# Altium schematic sheet power_supplies.SchDoc
size A4; SheetNumber: 2; SheetTotal: 8
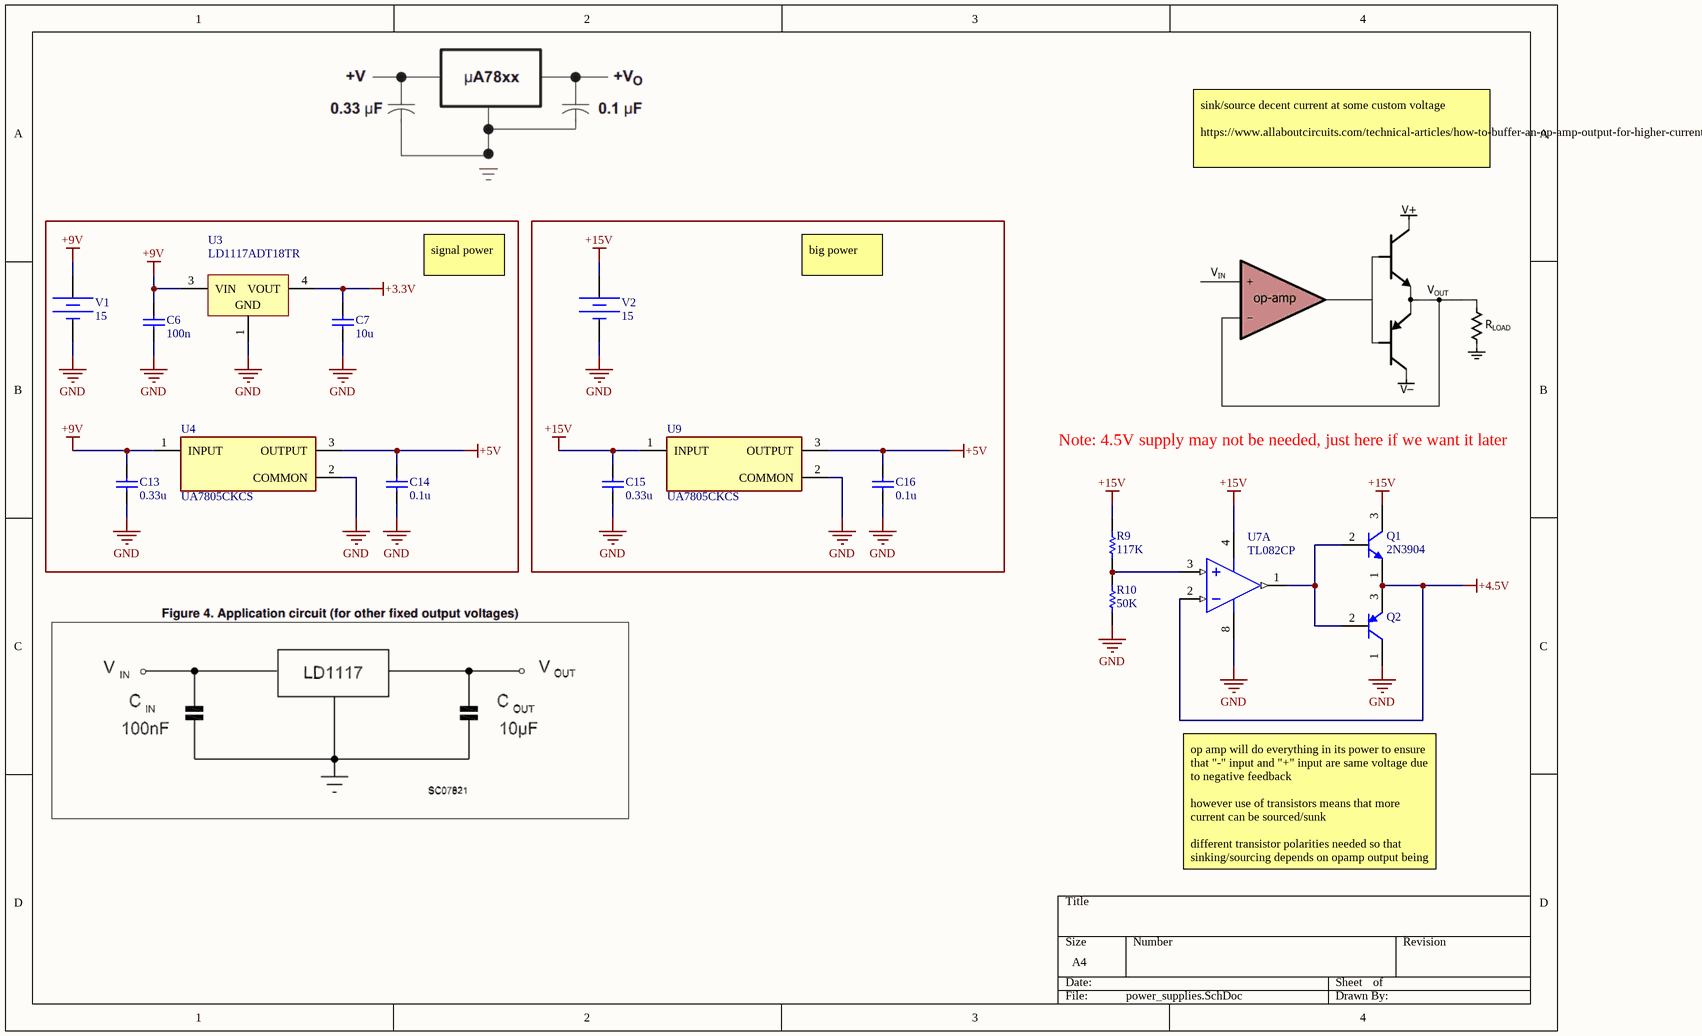
[diagram p0: power_supplies.SchDoc]

## Parts
C6  value 100n  (hidden comment: Capacitor)
C7  value 10u  (hidden comment: Capacitor)
C13  value 0.33u  (hidden comment: Capacitor)
C14  value 0.1u  (hidden comment: Capacitor)
C15  value 0.33u  (hidden comment: Capacitor)
C16  value 0.1u  (hidden comment: Capacitor)
Q1  2N3904  [ONSC-TO-92-3-29-11]
Q2  BC327-40ZL1G  [ONSC-TO-92-3-29-11_AM_BL]  (value not drawn)
R9  value 117K  (hidden comment: Resistor)
R10  value 50K  (hidden comment: Resistor)
U3  LD1117ADT18TR  [TO-252_N]
U4  UA7805CKCS  [FP-KCS0003B-MFG]
U7  TL082CP  [P0008A]  (part A of 2)
U9  UA7805CKCS  [FP-KCS0003B-MFG]
V1  DC Magnitude: 15  (hidden comment: Constant Voltage Source)
V2  DC Magnitude: 15  (hidden comment: Constant Voltage Source)

## Nets
+3.3V: C7.1 U3.4(VOUT)
+4.5V: Q1.1(E) Q2.3(E) U7.2(IN1-)
+5V: C14.1 C16.1 U4.3(OUTPUT) U9.3(OUTPUT)
+9V: C6.1 C13.1 U3.3(VIN) U4.1(INPUT) V1.1
+15V: C15.1 Q1.3(C) R9.1 U7.4(VCC-) U9.1(INPUT) V2.1
GND: C6.2 C7.2 C13.2 C14.2 C15.2 C16.2 Q2.1(C) R10.2 U3.1(GND) U4.2(COMMON) U7.8(VCC+) U9.2(COMMON) V1.2 V2.2
NetQ1_2: Q1.2(B) Q2.2(B) U7.1(OUT1)
NetR9_2: R9.2 R10.1 U7.3(IN1+)

## Notes on the sheet
- sink/source decent current at some custom voltage
  https://www.allaboutcircuits.com/technical-articles/how-to-buffer-an-op-amp-output-for-higher-current-part-2/
- signal power
- big power
- Note: 4.5V supply may not be needed, just here if we want it later
- op amp will do everything in its power to ensure that "-" input and "+" input are same voltage due to negative feedback
  however use of transistors means that more current can be sourced/sunk
  different transistor polarities needed so that sinking/sourcing depends on opamp output being positive or negative

## Library data of the parts
C6 C7 C13-C16 = Capacitor: SimulationGenericComponent: True
Q1 = CMP-2000-05562-1: General Purpose Transistor, NPN Silicon, 200 mA, 60 V, -55 to 150 degC, 3-Pin TO-92, RoHS, Bulk; Manufacturer: ONSemiconductor; Emitter- Base Voltage VEBO: 6V; Maximum Power Dissipation: 625mW; Maximum DC Collector Current: 0.2A; Collector- Emitter Voltage VCEO Max: 40V; Collector- Base Voltage VCBO: 60V; DC Collector/Base Gain hfe Min: 60; Configuration: Single; Collector-Emitter Saturation Voltage: 0.3V; Gain Bandwidth Product fT: 270MHz; Mounting Style: ThroughHole; Package / Case: TO-92-3(TO-226); Mounting Technology: ThroughHole; Minimum Operating Temperature: -65C; Datasheet Version: Rev. 8, 08/2012; Product Category: BipolarTransistors-BJT; Factory Pack Quantity: 5000; Transistor Polarity: NPN; Package Description: 3-Pin Transistor Outline, Body 4.825 x 3.685 mm, Pitch 1.27 mm; RoHS: Details; Datasheet URL: https://datasheet.ciiva.com/4725/2n3903-d-285841-4725808.pdf; Packaging: Bulk; Maximum Operating Temperature: +150C; Package Reference: TO-92-3-29-11; Brand: ONSemiconductor; Manufacturer URL: http://www.onsemi.com/
Q2 = CMP-1048-01589-1: Amplifier Transistor, PNP Silicon, 3-Pin TO-92, Pb-Free, Ammo Box; Manufacturer: On Semiconductor; IC Continuous (A): -0.8; ComponentLink2Description: Datasheet; ComponentLink1URL: http://www.onsemi.com/; Packing: Ammo Box; ComponentLink3Description: Package Specification; DatasheetVersion: Rev. 6; PartNumber: BC327-40ZL1G; PackageDescription: 3-Pin Transistor Outline, Body 4.825 x 3.685 mm, Pitch 1.27 mm; RoHS: TRUE; PackageReference: TO-92-3-29-11_AM_BL; Mounting Technology: Through Hole; ComponentLink1Description: Manufacturer URL; ComponentLink3URL: http://www.onsemi.com/pub_link/Collateral/MAC97-D.PDF; Polarity: PNP; PackageVersion: Rev. AM; ComponentLink2URL: http://www.onsemi.com/pub_link/Collateral/BC327-D.PDF
R9 R10 = Resistor: TC1: 0; SimulationGenericComponent: True; TC2: 0
U3 = CMP-0244-00136-1: 1A, Low Drop Positive Voltage Regulator, 1.8V, 3-Pin DPAK, Tape and Reel; DatasheetVersion: 2/12/2011; ComponentLink1Description: Manufacturer URL; ComponentLink1URL: http://www.st.com; ComponentLink2Description: Datasheet; PackageVersion: 2011; ComponentLink2URL: http://www.st.com/internet/com/TECHNICAL_RESOURCES/TECHNICAL_LITERATURE/DATASHEET/CD00002116.pdf; PackageReference: TO-252; PackageDescription: 3-Pin Transistor Outline Package 2.28 mm Pitch, 9.7 mm Lead Span (DPAK)
U4 U9 = CMP-04917-000031-1: IC REG LINEAR 5V 1.5A TO220-3; Manufacturer: Texas Instruments; Max Supply Voltage: 25V; Max Junction Temp: +125°C; Output Type: Fixed; Min Supply Voltage: 7V; Dropout Voltage: 2V; Number Of Outputs: 1; Category: IC; Height: 19.65mm; Temperature Range Low: 0°C; Device Class L1: Integrated Circuits (ICs); Manufacturer Part Number: UA7805CKCS; Device Class L3: Voltage Regulators - Linear; Temperature Range High: +125°C; Digikey Description: IC REG LINEAR 5V 1.5A TO220-3; Temperature: 0°C to +125°C; ComponentLink2Description: Datasheet; Lead Free: Yes; Device Class L2: Power Management ICs; Ipc Land Pattern Name: TO-220; Output Current: 1.5A; Output Voltage: 5V; Automotive: No; ComponentLink2URL: http://www.ti.com/lit/ds/symlink/ua78.pdf; Package: KCS0003B; Octopart: https://octopart.com/ua7805ckcs-texas+instruments-525328; Mouser Description: 1.5-A, 40-V, Fixed Positive Linear Regulators 3-TO-220 0 to 125; RoHS: TRUE
U7 = CMP-0055-00158-5: JFET-Input Operational Amplifier, 7 to 36 V, 0 to 70 degC, 8-pin DIP (P8), Pb-Free (RoHS); Manufacturer: Texas Instruments; Total Supply Voltage(Max)(+5V is 5, +/-5V is 10): 36; Rating: Catalog; Number of Channels: 2; Slew Rate(Typ)(V/us): 13; CMRR(Min)(dB): 70; Sub Family: General Purpose Amplifier, High Supply Voltage Amplifier (>=30V); Offset Drift(Typ)(uV/C): 18; Total Supply Voltage(Min)(+5V is 5, +/-5V is 10): 7; IIB(Max)(pA): 400; GBW(Typ)(MHz): 3; Iq per channel(Max)(mA): 2.8; Vio (25C)(Max)(mV): 15; PackageDescription: 8-Pin Plastic In-Line, Body 9.59 x 6.35 mm, Pitch 2.54 mm; ComponentLink2URL: http://www.ti.com/lit/ds/symlink/tl082.pdf; Mounting Technology: Through Hole; Code_JEDEC: MS-001; ComponentLink1Description: Manufacturer URL; ComponentLink3Description: Package Specification; PartNumber: TL082CP; PackageVersion: 4040082/E, 04/2010; Eco-Plan: Pb-Free (RoHS); ComponentLink1URL: http://www.ti.com/; PackageReference: P0008A; ComponentLink3URL: http://www.ti.com/litv/pdf/mpdi001b; DatasheetVersion: SLOS081G; ComponentLink2Description: Datasheet; Vn at 1kHz(Typ)(nV/rtHz): 18
V1 V2 = Battery: SimulationGenericComponent: True